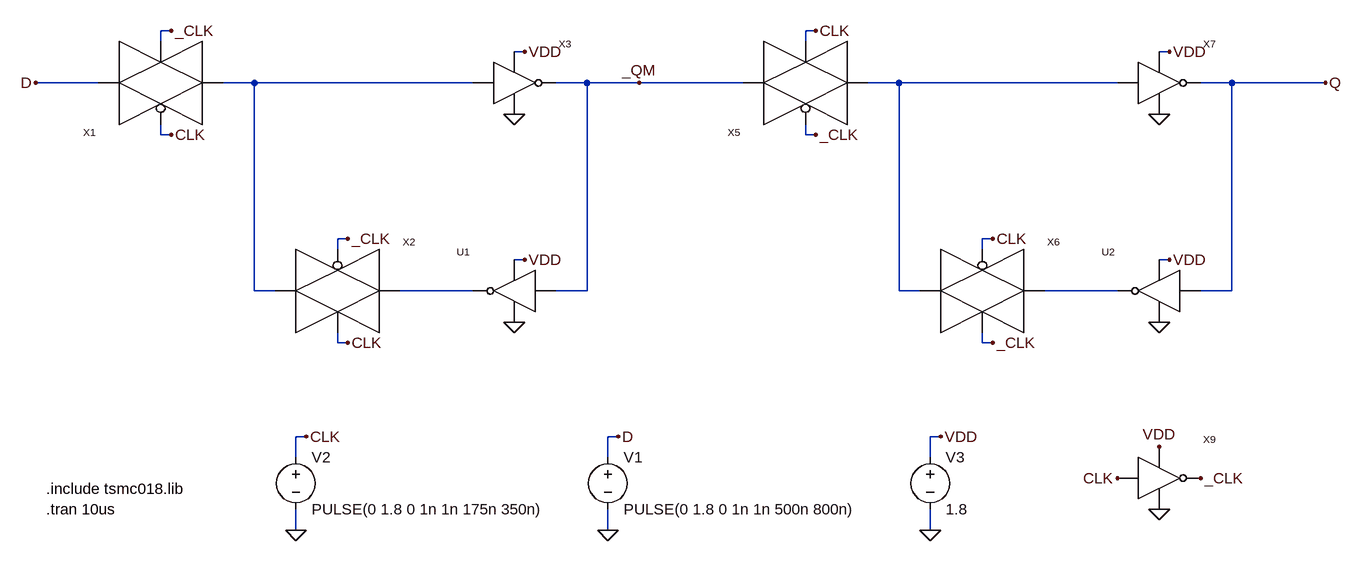
[diagram p0: schematic D_Flip_Flop.asc]
D_Flip_Flop.asc, the LTspice schematic file:
Version 4
SHEET 1 1812 964
WIRE 0 160 -16 160
WIRE 992 160 976 160
WIRE -16 176 -16 160
WIRE 976 176 976 160
WIRE 544 192 528 192
WIRE 1536 192 1520 192
WIRE -112 240 -208 240
WIRE 128 240 80 240
WIRE 464 240 128 240
WIRE 640 240 592 240
WIRE 720 240 640 240
WIRE 880 240 720 240
WIRE 1120 240 1072 240
WIRE 1456 240 1120 240
WIRE 1632 240 1584 240
WIRE 1776 240 1632 240
WIRE -16 320 -16 304
WIRE 0 320 -16 320
WIRE 976 320 976 304
WIRE 992 320 976 320
WIRE 272 480 256 480
WIRE 1264 480 1248 480
WIRE 256 496 256 480
WIRE 1248 496 1248 480
WIRE 544 512 528 512
WIRE 1536 512 1520 512
WIRE 128 560 128 240
WIRE 160 560 128 560
WIRE 464 560 352 560
WIRE 640 560 640 240
WIRE 640 560 592 560
WIRE 1120 560 1120 240
WIRE 1152 560 1120 560
WIRE 1456 560 1344 560
WIRE 1632 560 1632 240
WIRE 1632 560 1584 560
WIRE 256 640 256 624
WIRE 272 640 256 640
WIRE 1248 640 1248 624
WIRE 1264 640 1248 640
WIRE 208 784 192 784
WIRE 688 784 672 784
WIRE 1184 784 1168 784
WIRE 192 816 192 784
WIRE 672 816 672 784
WIRE 1168 816 1168 784
WIRE 192 928 192 896
WIRE 672 928 672 896
WIRE 1168 928 1168 896
FLAG 544 192 VDD
FLAG 528 288 0
FLAG 1536 192 VDD
FLAG 1520 288 0
FLAG 0 160 _CLK
FLAG 272 480 _CLK
FLAG 0 320 CLK
FLAG 272 640 CLK
FLAG 992 160 CLK
FLAG 1264 480 CLK
FLAG 992 320 _CLK
FLAG 1264 640 _CLK
FLAG -208 240 D
FLAG 1776 240 Q
FLAG 720 240 _QM
FLAG 1184 784 VDD
FLAG 688 784 D
FLAG 208 784 CLK
FLAG 192 928 0
FLAG 672 928 0
FLAG 1168 928 0
FLAG 1584 848 _CLK
FLAG 1456 848 CLK
FLAG 1520 800 VDD
FLAG 1520 896 0
FLAG 544 512 VDD
FLAG 1536 512 VDD
FLAG 528 608 0
FLAG 1520 608 0
SYMBOL transmission_gate -16 256 R180
SYMATTR InstName X1
SYMBOL transmission_gate 256 544 R0
SYMATTR InstName X2
SYMBOL inverter 528 240 R0
SYMATTR InstName X3
SYMBOL transmission_gate 976 256 R180
SYMATTR InstName X5
SYMBOL transmission_gate 1248 544 R0
SYMATTR InstName X6
SYMBOL inverter 1520 240 R0
SYMATTR InstName X7
SYMBOL voltage 672 800 R0
WINDOW 123 0 0 Left 0
WINDOW 39 0 0 Left 0
SYMATTR InstName V1
SYMATTR Value PULSE(0 1.8 0 1n 1n 500n 800n)
SYMBOL voltage 192 800 R0
WINDOW 123 0 0 Left 0
WINDOW 39 0 0 Left 0
SYMATTR InstName V2
SYMATTR Value PULSE(0 1.8 0 1n 1n 175n 350n)
SYMBOL voltage 1168 800 R0
WINDOW 123 0 0 Left 0
WINDOW 39 0 0 Left 0
SYMATTR InstName V3
SYMATTR Value 1.8
SYMBOL inverter 1520 848 R0
SYMATTR InstName X9
SYMBOL inverter 528 560 M0
SYMATTR InstName U1
SYMBOL inverter 1520 560 M0
SYMATTR InstName U2
TEXT -192 864 Left 2 !.include tsmc018.lib
TEXT -192 896 Left 2 !.tran 10us

The netlist it stands for:
* D_Flip_Flop.asc
XX1 N001 D CLK _CLK transmission_gate  ; pins V1 V2 _VC VC
XX2 N001 N003 _CLK CLK transmission_gate  ; pins V1 V2 _VC VC
XX3 N001 _QM VDD 0 inverter  ; pins VIN VOUT VDD VSS
XX5 N002 _QM _CLK CLK transmission_gate  ; pins V1 V2 _VC VC
XX6 N002 N004 CLK _CLK transmission_gate  ; pins V1 V2 _VC VC
XX7 N002 Q VDD 0 inverter  ; pins VIN VOUT VDD VSS
V1 D 0 PULSE(0 1.8 0 1n 1n 500n 800n)
V2 CLK 0 PULSE(0 1.8 0 1n 1n 175n 350n)
V3 VDD 0 1.8
XX9 CLK _CLK VDD 0 inverter  ; pins VIN VOUT VDD VSS
XU1 _QM N003 VDD 0 inverter  ; pins VIN VOUT VDD VSS
XU2 Q N004 VDD 0 inverter  ; pins VIN VOUT VDD VSS
.include tsmc018.lib
.tran 10us
.lib transmission_gate.sub
.lib inverter.sub
.backanno
.end